# EAGLE design Backplane (EAGLE 9.5.1)

## Sheet 1 of 2
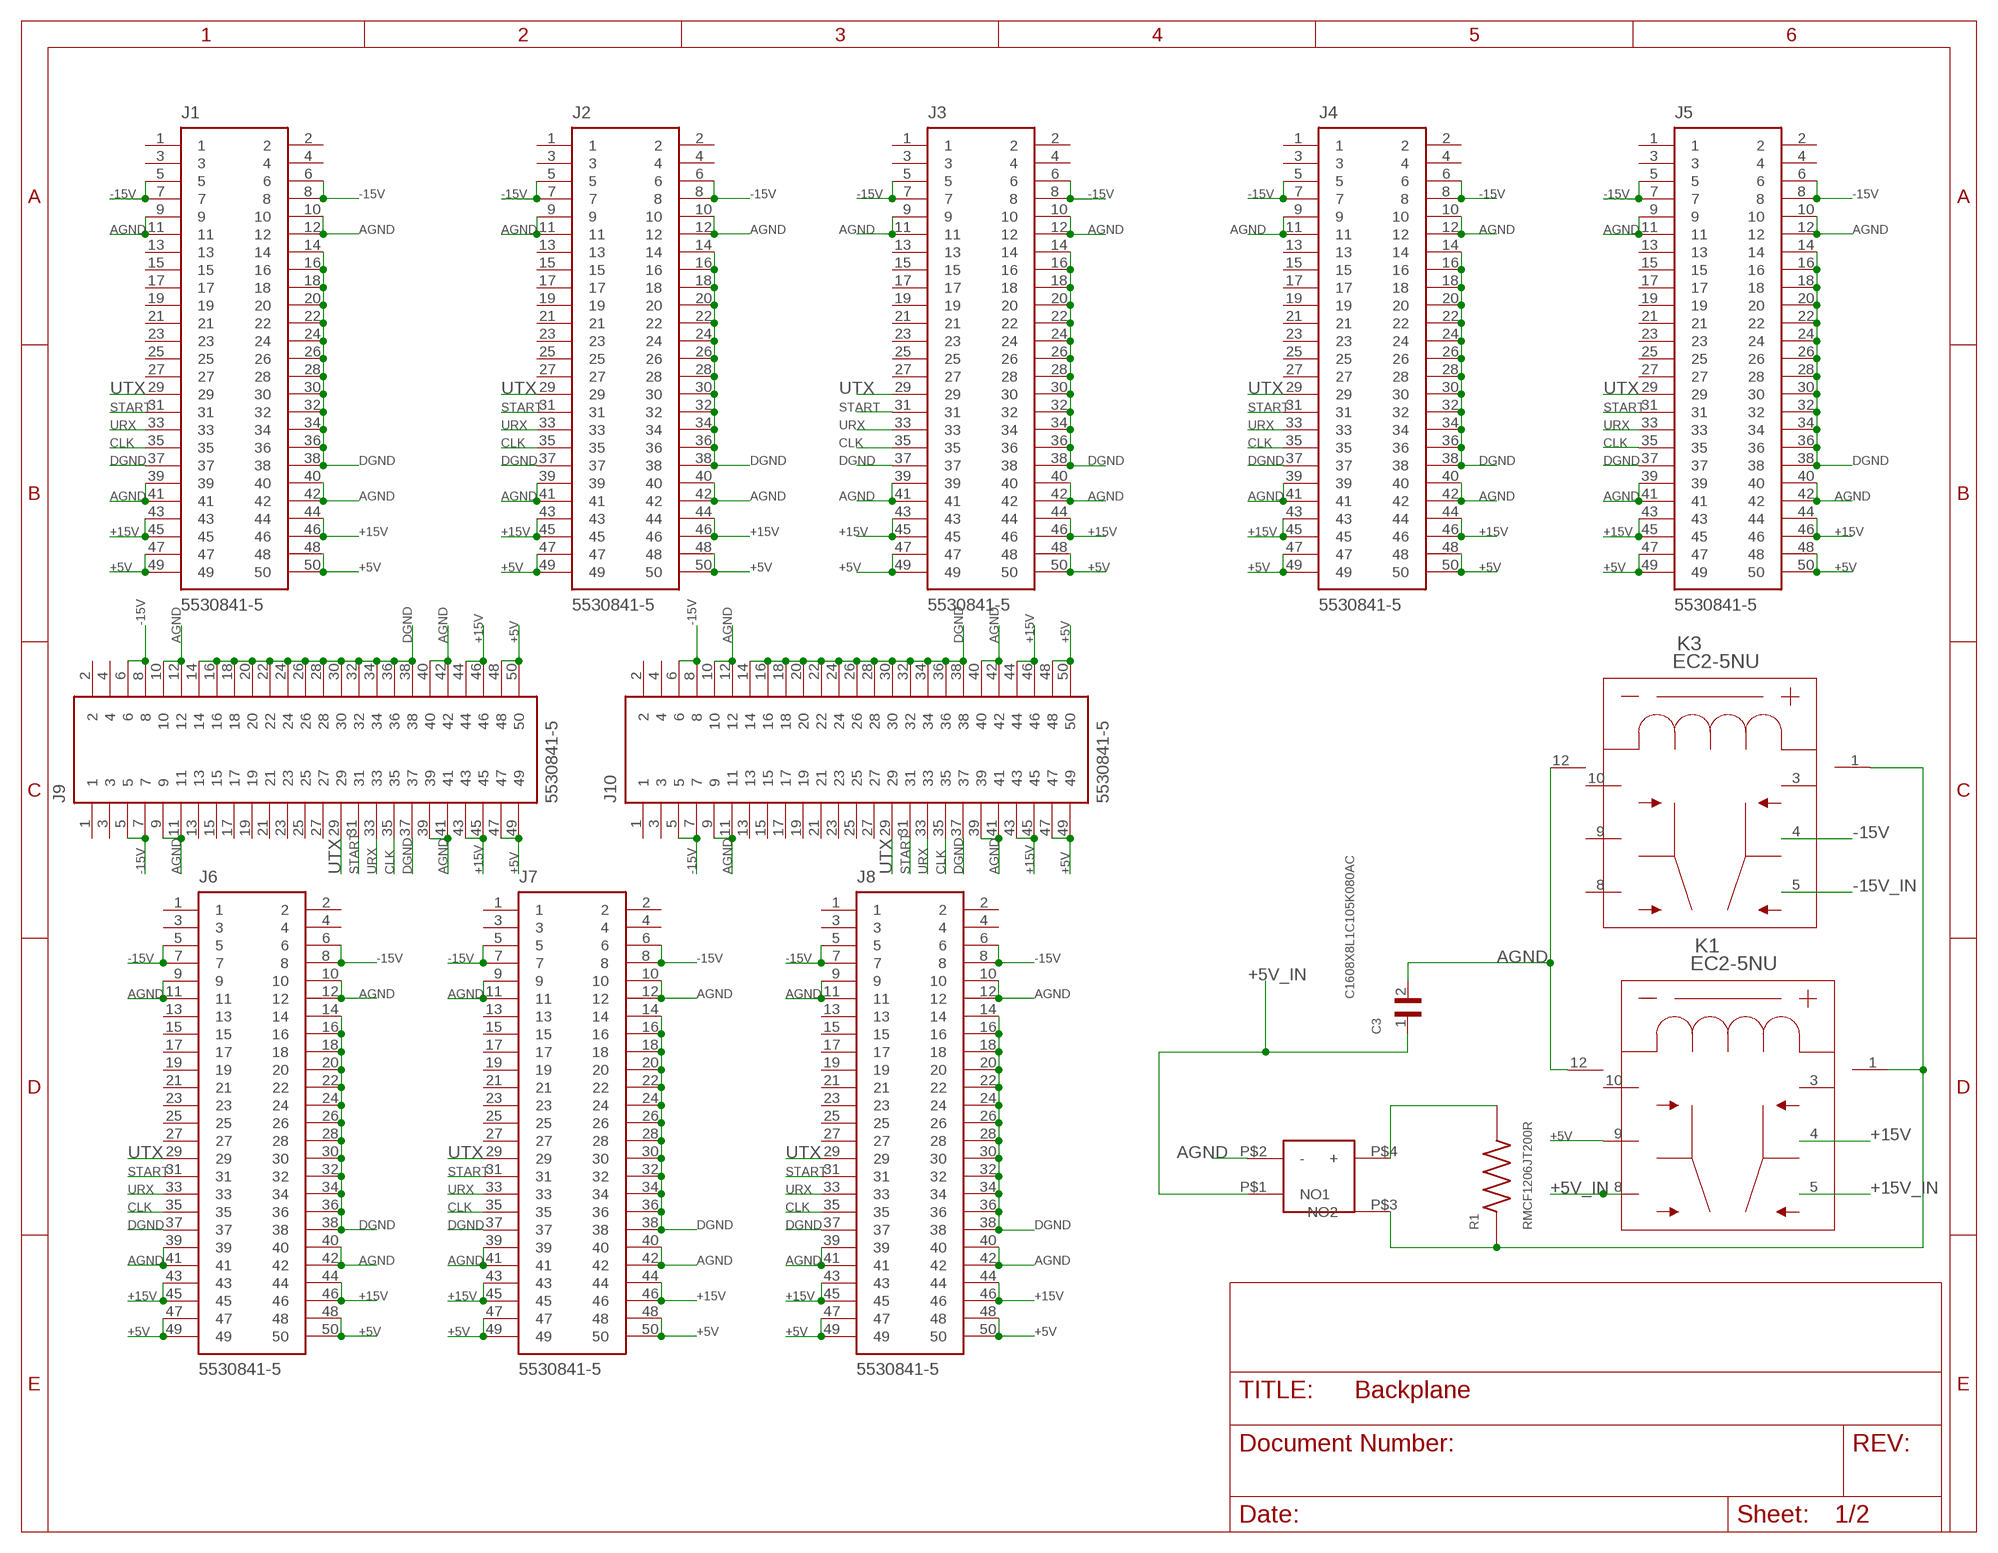
[diagram p0: schematic, sheet 1]

### Parts
C3  C1608X8L1C105K080AC  [CAPC1608X90N]
J1  5530841-5  [TE_5530841-5]
J2  5530841-5  [TE_5530841-5]
J3  5530841-5  [TE_5530841-5]
J4  5530841-5  [TE_5530841-5]
J5  5530841-5  [TE_5530841-5]
J6  5530841-5  [TE_5530841-5]
J7  5530841-5  [TE_5530841-5]
J8  5530841-5  [TE_5530841-5]
J9  5530841-5  [TE_5530841-5]
J10  5530841-5  [TE_5530841-5]
K1  EC2-5NU  [EC2NU]
K3  EC2-5NU  [EC2NU]
R1  RMCF1206JT200R  [RESC3216X70N]
U$1  BUTTON_DEV  [BUTTON_FOOT]

### Nets
+5V: J1.47 J1.48 J1.49 J1.50 J2.47 J2.48 J2.49 J2.50 J3.47 J3.48 J3.49 J3.50 J4.47 J4.48 J4.49 J4.50 J5.47 J5.48 J5.49 J5.50 J6.47 J6.48 J6.49 J6.50 J7.47 J7.48 J7.49 J7.50 J8.47 J8.48 J8.49 J8.50 J9.47 J9.48 J9.49 J9.50 J10.47 J10.48 J10.49 J10.50 K1.9
+5V_IN: C3.1 K1.8 U$1.P$1(NO1) ; also sheet 2
+15V: J1.43 J1.44 J1.45 J1.46 J2.43 J2.44 J2.45 J2.46 J3.43 J3.44 J3.45 J3.46 J4.43 J4.44 J4.45 J4.46 J5.43 J5.44 J5.45 J5.46 J6.43 J6.44 J6.45 J6.46 J7.43 J7.44 J7.45 J7.46 J8.43 J8.44 J8.45 J8.46 J9.43 J9.44 J9.45 J9.46 J10.43 J10.44 J10.45 J10.46 K1.4
+15V_IN: K1.5 ; also sheet 2
-15V: J1.5 J1.6 J1.7 J1.8 J2.5 J2.6 J2.7 J2.8 J3.5 J3.6 J3.7 J3.8 J4.5 J4.6 J4.7 J4.8 J5.5 J5.6 J5.7 J5.8 J6.5 J6.6 J6.7 J6.8 J7.5 J7.6 J7.7 J7.8 J8.5 J8.6 J8.7 J8.8 J9.5 J9.6 J9.7 J9.8 J10.5 J10.6 J10.7 J10.8 K3.4
-15V_IN: K3.5 ; also sheet 2
AGND: C3.2 J1.9 J1.10 J1.11 J1.12 J1.39 J1.40 J1.41 J1.42 J2.9 J2.10 J2.11 J2.12 J2.39 J2.40 J2.41 J2.42 J3.9 J3.10 J3.11 J3.12 J3.39 J3.40 J3.41 J3.42 J4.9 J4.10 J4.11 J4.12 J4.39 J4.40 J4.41 J4.42 J5.9 J5.10 J5.11 J5.12 J5.39 J5.40 J5.41 J5.42 J6.9 J6.10 J6.11 J6.12 J6.39 J6.40 J6.41 J6.42 J7.9 J7.10 J7.11 J7.12 J7.39 J7.40 J7.41 J7.42 J8.9 J8.10 J8.11 J8.12 J8.39 J8.40 J8.41 J8.42 J9.9 J9.10 J9.11 J9.12 J9.39 J9.40 J9.41 J9.42 J10.9 J10.10 J10.11 J10.12 J10.39 J10.40 J10.41 J10.42 K1.12 K3.12 U$1.P$2(-) ; also sheet 2
CLK: J1.35 J2.35 J3.35 J4.35 J5.35 J6.35 J7.35 J8.35 J9.35 J10.35 ; also sheet 2
DGND: J1.14 J1.16 J1.18 J1.20 J1.22 J1.24 J1.26 J1.28 J1.30 J1.32 J1.34 J1.36 J1.37 J1.38 J2.14 J2.16 J2.18 J2.20 J2.22 J2.24 J2.26 J2.28 J2.30 J2.32 J2.34 J2.36 J2.37 J2.38 J3.14 J3.16 J3.18 J3.20 J3.22 J3.24 J3.26 J3.28 J3.30 J3.32 J3.34 J3.36 J3.37 J3.38 J4.14 J4.16 J4.18 J4.20 J4.22 J4.24 J4.26 J4.28 J4.30 J4.32 J4.34 J4.36 J4.37 J4.38 J5.14 J5.16 J5.18 J5.20 J5.22 J5.24 J5.26 J5.28 J5.30 J5.32 J5.34 J5.36 J5.37 J5.38 J6.14 J6.16 J6.18 J6.20 J6.22 J6.24 J6.26 J6.28 J6.30 J6.32 J6.34 J6.36 J6.37 J6.38 J7.14 J7.16 J7.18 J7.20 J7.22 J7.24 J7.26 J7.28 J7.30 J7.32 J7.34 J7.36 J7.37 J7.38 J8.14 J8.16 J8.18 J8.20 J8.22 J8.24 J8.26 J8.28 J8.30 J8.32 J8.34 J8.36 J8.37 J8.38 J9.14 J9.16 J9.18 J9.20 J9.22 J9.24 J9.26 J9.28 J9.30 J9.32 J9.34 J9.36 J9.37 J9.38 J10.14 J10.16 J10.18 J10.20 J10.22 J10.24 J10.26 J10.28 J10.30 J10.32 J10.34 J10.36 J10.37 J10.38 ; also sheet 2
N$3: R1.2 U$1.P$4(+)
N$5: K1.1 K3.1 R1.1 U$1.P$3(NO2)
START: J1.31 J2.31 J3.31 J4.31 J5.31 J6.31 J7.31 J8.31 J9.31 J10.31 ; also sheet 2
URX: J1.33 J2.33 J3.33 J4.33 J5.33 J6.33 J7.33 J8.33 J9.33 J10.33 ; also sheet 2
UTX: J1.29 J2.29 J3.29 J4.29 J5.29 J6.29 J7.29 J8.29 J9.29 J10.29 ; also sheet 2
Unconnected: J1.1 J1.2 J1.3 J1.4 J1.13 J1.15 J1.17 J1.19 J1.21 J1.23 J1.25 J1.27 J2.1 J2.2 J2.3 J2.4 J2.13 J2.15 J2.17 J2.19 J2.21 J2.23 J2.25 J2.27 J3.1 J3.2 J3.3 J3.4 J3.13 J3.15 J3.17 J3.19 J3.21 J3.23 J3.25 J3.27 J4.1 J4.2 J4.3 J4.4 J4.13 J4.15 J4.17 J4.19 J4.21 J4.23 J4.25 J4.27 J5.1 J5.2 J5.3 J5.4 J5.13 J5.15 J5.17 J5.19 J5.21 J5.23 J5.25 J5.27 J6.1 J6.2 J6.3 J6.4 J6.13 J6.15 J6.17 J6.19 J6.21 J6.23 J6.25 J6.27 J7.1 J7.2 J7.3 J7.4 J7.13 J7.15 J7.17 J7.19 J7.21 J7.23 J7.25 J7.27 J8.1 J8.2 J8.3 J8.4 J8.13 J8.15 J8.17 J8.19 J8.21 J8.23 J8.25 J8.27 J9.1 J9.2 J9.3 J9.4 J9.13 J9.15 J9.17 J9.19 J9.21 J9.23 J9.25 J9.27 J10.1 J10.2 J10.3 J10.4 J10.13 J10.15 J10.17 J10.19 J10.21 J10.23 J10.25 J10.27 K1.3 K1.10 K3.3 K3.8 K3.9 K3.10

## Sheet 2 of 2
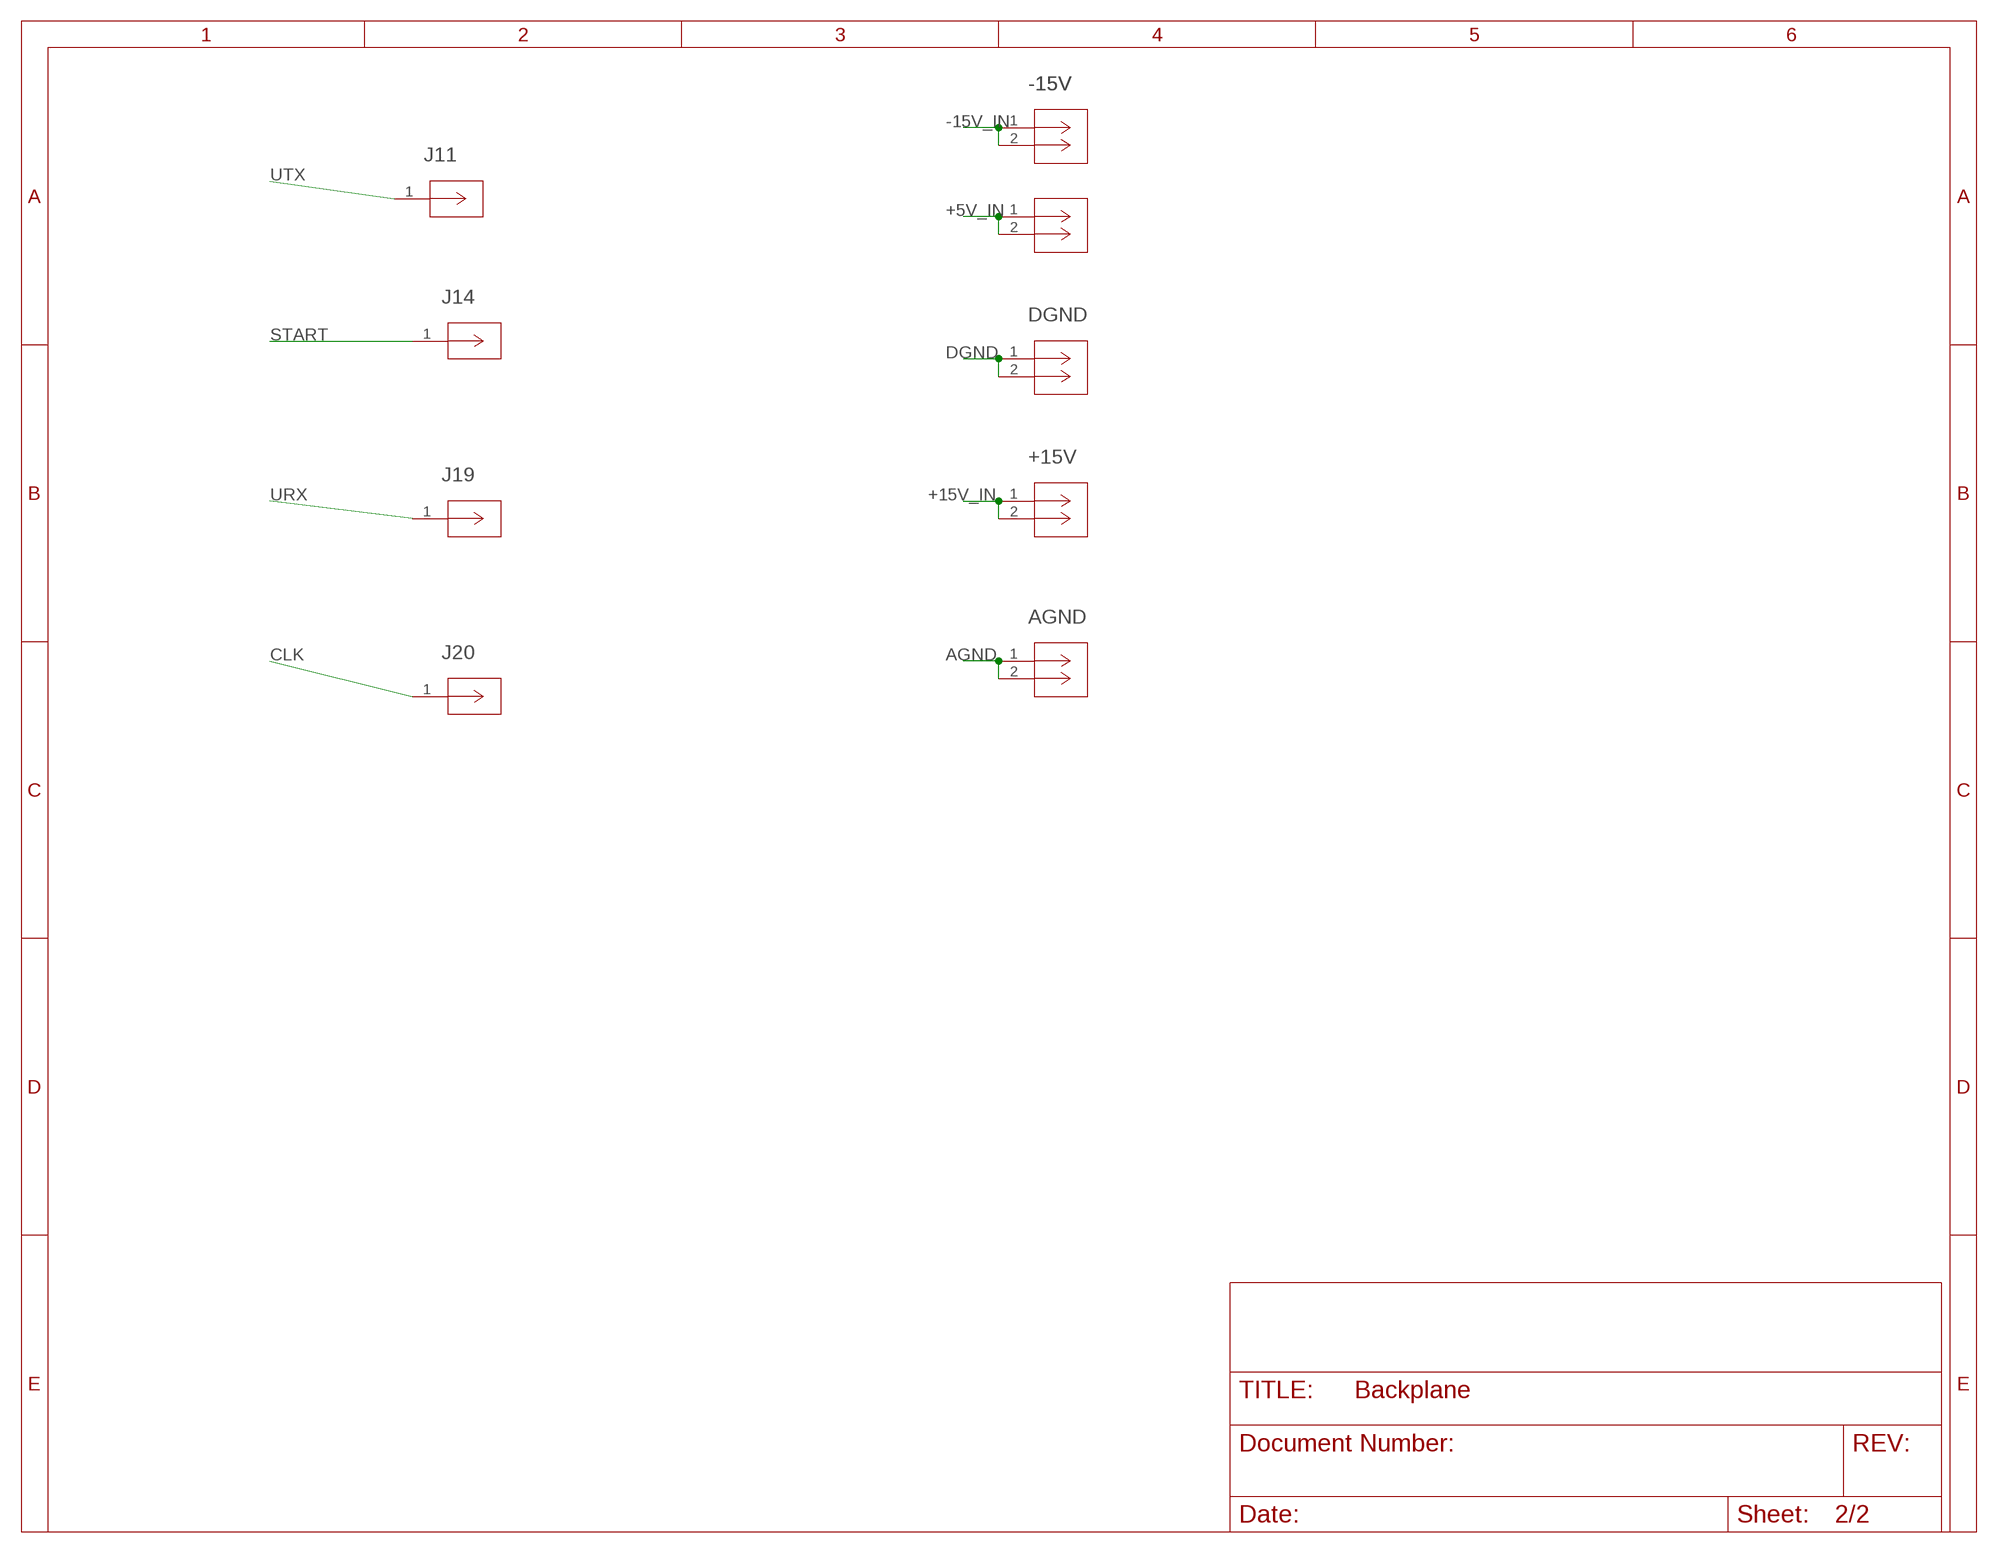
[diagram p1: schematic, sheet 2]

### Parts
+5V  24.243.1  [CONN_24.243_MTC]
+15V  24.243.1  [CONN_24.243_MTC]
-15V  24.243.1  [CONN_24.243_MTC]
AGND  24.243.1  [CONN_24.243_MTC]
DGND  24.243.1  [CONN_24.243_MTC]
J11  112404  [CONN_112404_AMP]
J14  112404  [CONN_112404_AMP]
J19  112404  [CONN_112404_AMP]
J20  112404  [CONN_112404_AMP]

### Nets
+5V_IN: +5V.1 +5V.2 ; also sheet 1
+15V_IN: +15V.1 +15V.2 ; also sheet 1
-15V_IN: -15V.1 -15V.2 ; also sheet 1
AGND: AGND.1 AGND.2 ; also sheet 1
CLK: J20.1 ; also sheet 1
DGND: DGND.1 DGND.2 ; also sheet 1
START: J14.1 ; also sheet 1
URX: J19.1 ; also sheet 1
UTX: J11.1 ; also sheet 1

## Library data of the parts
+5V -15V = 39F1574:24.243.1; COPYRIGHT: Copyright (C) 2022 Ultra Librarian. All rights reserved.; MANUFACTURER_PART_NUMBER: 24.243.1; MFR_NAME: Multicomp
+15V AGND DGND = Banana_connector_24.243.1:24.243.1; BUILT_BY: EMA_Justin; COPYRIGHT: Copyright (C) 2018 Accelerated Designs. All rights reserved; DATASHEET: http://www.farnell.com/datasheets/1901211.pdf?_ga=2.209271186.1695985900.1582574926-861621671.1572890216&_gac=1.224104297.1582574926.CjwKCAiAhc7yBRAdEiwAplGxX0eXyKiGfj62eRMGG7KvwS8fdWH6vWjmriwTUSfyzPNlkVLVCkx_YhoCwGcQAvD_BwE; MANUFACTURER_PART_NUMBER: 24.243.1; SOURCELIBRARY: Multicomp_2020-02-25; VENDOR: Multicomp
C3 = 1uF_cap_C1608X8L1C105K080AC:C1608X8L1C105K080AC; DESCRIPTION: 1µF ±10% 16V Ceramic Capacitor X8L 0603 (1608 Metric); DIGI-KEY_PART_NUMBER: 445-175407-1-ND; MF: TDK; MP: C1608X8L1C105K080AC; PACKAGE: 1608 TDK
J1-J10 = cardEdge5530841-5:5530841-5: Conn Power Card Edge SKT 50 POS 2.54mm Solder ST Thru-Hole; COMMENT: 5530841-5; DESCRIPTION: Conn Power Card Edge SKT 50 POS 2.54mm Solder ST Thru-Hole; DIGI-KEY_PART_NUMBER: 5530841-5-ND; EU_ROHS_COMPLIANCE: Compliant; MF: TE Connectivity; MP: 5530841-5; PACKAGE: None; PURCHASE-URL: https://pricing.snapeda.com/search/part/5530841-5/?ref=eda
J11 J14 J19 J20 = 39F1574:112404; COPYRIGHT: Copyright (C) 2022 Ultra Librarian. All rights reserved.; DIGI-KEY_PART_NUMBER_1: ACX1051-ND; MANUFACTURER_PART_NUMBER: 112404; MFR_NAME: Amphenol ICC
K1 K3 = EC2-5NU:EC2-5NU: EC2-5NU : RELAY GEN PURPOSE DPDT 2A 5V. Miniature Signal Relay, Non-latch; COIL_RESISTANCE: 178 Ohm; COIL_TYPE: Non Latching; CONTACT_CONFIGURATION: DPDT; CONTACT_CURRENT: 5A; CONTACT_VOLTAGE_DC: 220V; CONTACT_VOLTAGE_VAC: 250V; MANUFACTURER_PART_NUMBER: EC25NU; MPN: EC2-5NU; SHORTCUT: EC2; VENDOR: KEMET
R1 = 200ohm_res_RMCF1206JT200R:RMCF1206JT200R; DESCRIPTION: 200 Ohms ±5% 0.25W, 1/4W Chip Resistor 1206 (3216 Metric) Automotive AEC-Q200 Thick Film; DIGI-KEY_PART_NUMBER: RMCF1206JT200RCT-ND; MF: Stackpole Electronics Inc; MP: RMCF1206JT200R; PACKAGE: 3216 Stackpole
U$1 = button_new:BUTTON_DEV

## Board
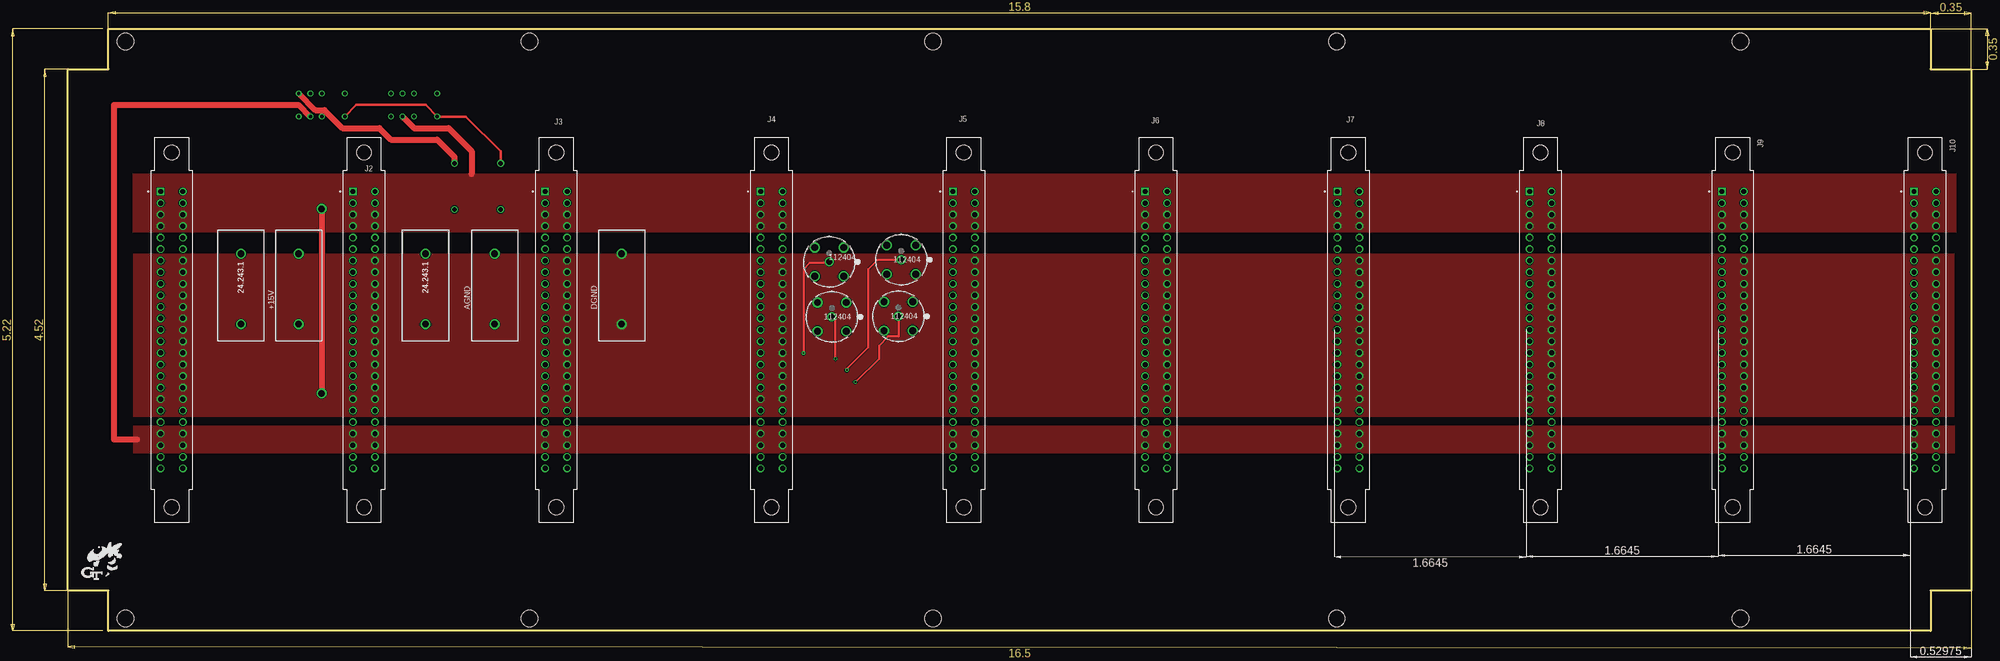
[diagram p2: board, top side]
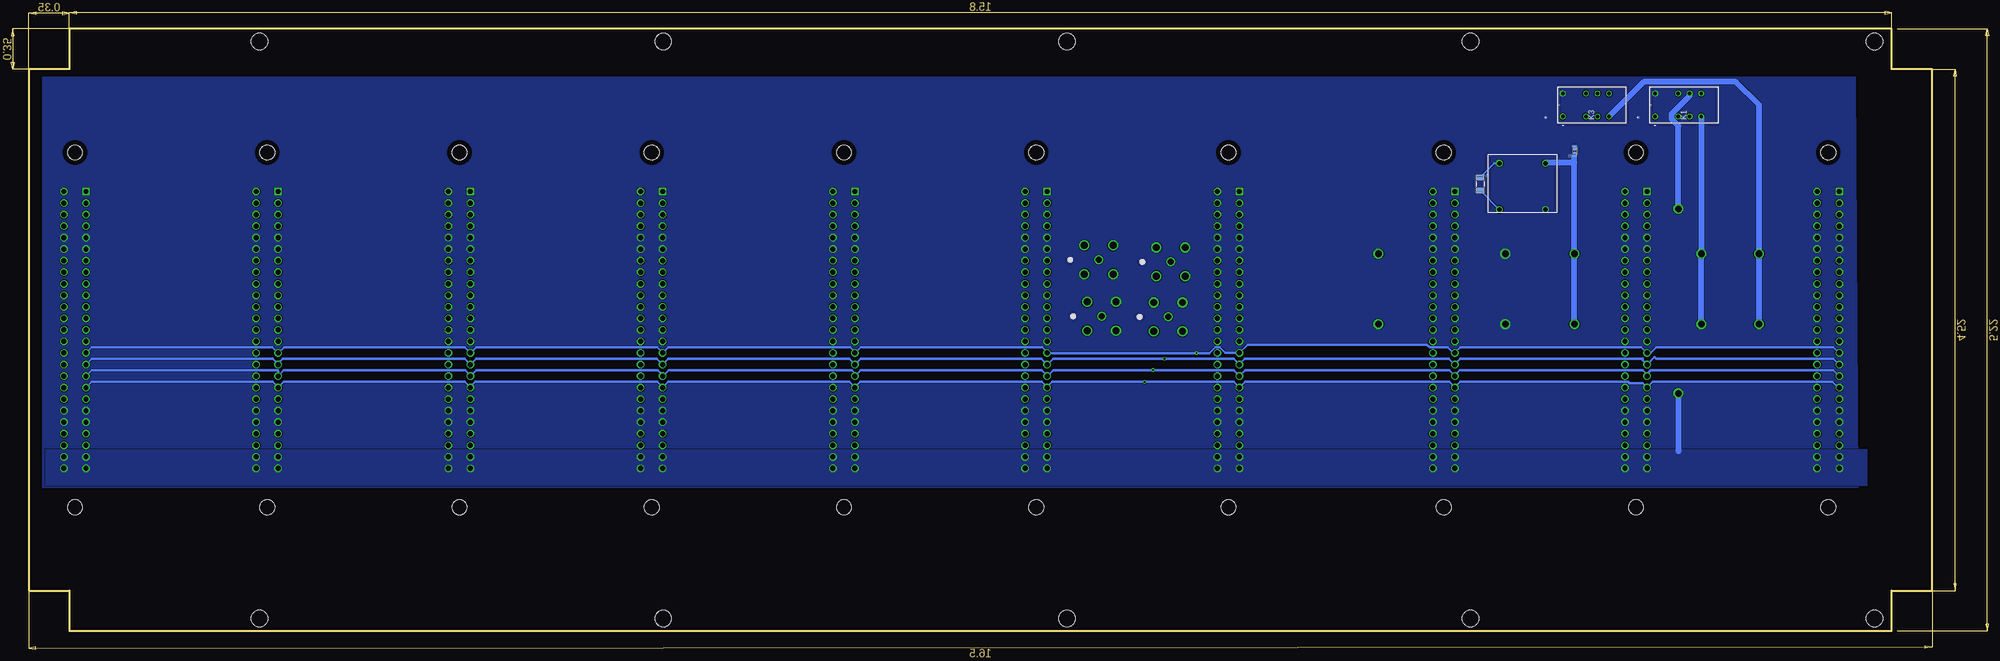
[diagram p3: board, bottom side, seen from below]

Size 419.1 x 132.59 mm. Coordinates in mm from the lower left corner, seen from the top.
Outline: 8.89,132.59 410.21,132.59 410.21,123.7 419.1,123.7 419.1,8.89 410.21,8.89 410.21,0 8.89,0 8.89,8.89 0,8.89 0,123.7 8.89,123.7 8.89,132.59
Copper layers (1*16): Top 0.01778125mm / dielectric 12mil / Bottom 0.01778125mm
Design rules "default *": minimum track width 6mil, minimum drill 0.35mm, track to track 6mil, track to pad 6mil, pad to pad 6mil, via to via 6mil, smd to smd 6mil, copper to edge 40mil, drill to drill 6mil, minimum pad ring 10mil, minimum via ring 8mil, stop-mask expansion 4mil, vias tented up to drill 0mil, thermal gap 10mil
Holes 3.66 mm at 12.7,129.84 190.5,129.84 101.6,129.84 279.4,129.84 101.6,2.74 368.3,129.84 12.7,2.74 190.5,2.74 279.4,2.74 368.3,2.74

### Footprints (pad centres in the part's own frame; a part is rotated, then mirrored left to right if it is on the bottom)
CONN_24.243_MTC = drill 1.448 pad 1.956: 1 0,0; 2 15.494,0
CAPC1608X90N = smd 1.01 x 0.93: 1 -0.709,0; 2 0.709,0
TE_5530841-5 = drill 1.1 square: 1 -30.48,-2.425 | drill 1.1: 2 -30.48,2.425; 3 -27.94,-2.425; 4 -27.94,2.425; 5 -25.4,-2.425; 6 -25.4,2.425; 7 -22.86,-2.425; 8 -22.86,2.425; 9 -20.32,-2.425; 10 -20.32,2.425; 11 -17.78,-2.425; 12 -17.78,2.425; 13 -15.24,-2.425; 14 -15.24,2.425; 15 -12.7,-2.425; 16 -12.7,2.425; 17 -10.16,-2.425; 18 -10.16,2.425; 19 -7.62,-2.425; 20 -7.62,2.425; 21 -5.08,-2.425; 22 -5.08,2.425; 23 -2.54,-2.425; 24 -2.54,2.425; 25 0,-2.425; 26 0,2.425; 27 2.54,-2.425; 28 2.54,2.425; 29 5.08,-2.425; 30 5.08,2.425; 31 7.62,-2.425; 32 7.62,2.425; 33 10.16,-2.425; 34 10.16,2.425; 35 12.7,-2.425; 36 12.7,2.425; 37 15.24,-2.425; 38 15.24,2.425; 39 17.78,-2.425; 40 17.78,2.425; 41 20.32,-2.425; 42 20.32,2.425; 43 22.86,-2.425; 44 22.86,2.425; 45 25.4,-2.425; 46 25.4,2.425; 47 27.94,-2.425; 48 27.94,2.425; 49 30.48,-2.425; 50 30.48,2.425 | hole 3.3: -39.05,0; 39.05,0
CONN_112404_AMP = drill 1.295 pad 1.803: 1 0,0 | drill 1.499 pad 2.007: 2 -3.175,3.175; 3 3.175,3.175; 4 -3.175,-3.175; 5 3.175,-3.175
EC2NU = drill 0.762 pad 1.27: 1 -5.08,12.725; 3 -5.08,7.645; 4 -5.08,5.105; 5 -5.08,2.565; 8 0,2.565; 9 0,5.105; 10 0,7.645; 12 0,12.725
RESC3216X70N = smd 1.23 x 1.77: 1 -1.466,0; 2 1.466,0
BUTTON_FOOT = drill 1: P$1 0,0; P$2 0,10.16; P$3 10.16,0; P$4 10.16,10.16

### Placement (x,y rotation side)
+5V  78.74,67.56 90 top
+15V  50.8,67.56 90 top
-15V  38.1,67.56 90 top
AGND  93.98,67.56 90 top
C3  78.74,105.66 90 bottom
DGND  121.92,67.56 90 top
DRILEGEND  [DRILEGEND]  -15.3,-11.53 0 top  (outside the outline)
J1  22.86,66.29 270 top
J2  65.19,66.29 270 top
J3  107.53,66.29 270 top
J4  154.94,66.29 270 top
J5  197.28,66.29 270 top
J6  239.61,66.29 270 top
J7  281.95,66.29 270 top
J8  324.28,66.29 270 top
J9  366.61,66.29 270 top
J10  408.95,66.29 270 top
J11  167.65,81.29 0 top
J14  168.22,69.17 0 top
J19  183.51,81.75 0 top
J20  182.87,69.3 0 top
K1  48.26,118.36 90 bottom
K3  68.58,118.36 90 bottom
R1  99.55,98.43 270 bottom
U$1  85.11,102.97 180 bottom

### Tracks (layer width: path | path; a pad name or v marks a point on that pad's centre or on a via)
+5V  (via drill 1.45)
  Top 1.27: v55.88,92.96 v55.88,52.32
  Bottom 1.27: v55.88,52.32 55.88,39.62 | K1.9 53.37,117.84 57.33,113.87 57.33,112.7 55.88,111.25 v55.88,92.96
  pour Bottom (no thermals): 14.35,31.98 415.43,31.98 415.43,40.11 14.35,40.05
+5V_IN
  Top 1.27: K1.8 54.48,114.71 56.49,114.71 60.46,110.74 68.58,110.74 71.12,108.2 81.28,108.2 85.11,104.37 U$1.P$1
  Bottom 1.27: +5V.1 +5V.2 78.74,103.12 | 78.74,103.12 C3.1 | 78.74,103.12 84.95,103.12 U$1.P$1
+15V
  Top 1.27: 15.24,42.16 10.16,42.16 10.16,115.82 50.83,115.82 K1.4
  pour Top (no thermals): 14.43,39.2 415.47,39.2 415.47,45.16 14.38,45.06
+15V_IN
  Bottom 1.27: +15V.1 +15V.2 50.8,113.26 K1.5
-15V
  Top 1.27: K3.4 76.2,110.77 76.2,110.74 83.82,110.74 88.9,105.66 88.9,100.58
  pour Top (no thermals): 415.72,87.83 14.4,87.83 14.4,100.69 415.72,100.69
-15V_IN
  Bottom 1.27: -15V.1 -15V.2 38.1,115.82 43.18,120.9 63.52,120.9 K3.5
AGND
  pour Bottom (rank 2, no thermals): 16.4,31.57 416.04,31.57 416.04,122.08 16.88,122.08
CLK  (via drill 0.35)
  Top 0.508: J20.1 182.97,69.2 182.97,64.87 180.68,64.87 178.65,62.84 178.61,62.84 178.61,59.94 173.49,54.83 v173.38,54.83
  Bottom 0.152: J5.35 194.94,53.69 | 364.19,53.67 J9.35 | 321.96,53.7 J8.35
  Bottom 0.508: J1.35 20.69,53.59 22,54.89 61.47,54.89 J2.35 63.74,54.56 66.68,54.56 66.95,54.84 103.86,54.84 J3.35 106.35,54.84 151.27,54.84 J4.35 153.75,54.83 v173.38,54.83 193.77,54.83 194.94,53.69 196.08,54.83 236.08,54.83 J6.35 238.45,54.86 278.25,54.86 J7.35 280.75,54.83 320.83,54.83 321.96,53.7 323.12,54.86 362.92,54.86 J9.35 | J10.35 405.27,54.84 365.36,54.84 364.19,53.67
DGND
  pour Top (no thermals): 14.4,82.96 14.4,47.23 415.4,47.23 415.4,82.96
N$3
  Bottom 0.508: U$1.P$4 99.43,96.96 R1.2
N$5
  Top 0.508: U$1.P$3 95.27,105.66 87.65,113.28 K3.1 81.28,113.28 78.74,115.82 63.52,115.82 K1.1
  Bottom 0.508: R1.1 96.41,103.04 95.34,103.04 U$1.P$3
START  (via drill 0.35)
  Top 0.508: J14.1 169.02,68.38 v169.02,59.95
  Bottom 0.152: 61.14,60.3 61.12,60.3 | 63.72,59.91 63.72,59.62 | 152.52,58.85 J4.31 | J9.31 364.19,58.9
  Bottom 0.508: J1.31 21.71,59.95 60.77,59.95 61.12,60.3 | 61.14,60.3 J2.31 63.72,59.62 | 63.72,59.91 103.86,59.91 J3.31 106.4,59.97 108.56,59.97 108.56,59.96 151.41,59.96 152.52,58.85 | J4.31 153.79,59.95 168.9,59.95 | J10.31 405.28,59.92 365.43,59.92 J9.31 | 364.19,58.9 363.14,59.94 323.12,59.94 J8.31 320.58,59.95 280.8,59.95 J7.31 278.25,59.94 238.45,59.94 J6.31 235.9,59.96 196.17,59.96 194.88,58.67 J5.31 193.57,59.96 168.91,59.96 168.9,59.95 | 168.9,59.95 v169.02,59.95
URX  (via drill 0.35)
  Top 0.508: J19.1 178.35,81.75 176.29,79.69 176.29,62.48 171.53,57.73 v171.53,57.43
  Bottom 0.152: 62.77,56.54 J2.33 62.77,56.48 | 105.1,56.26 J3.33 | 321.85,56.21 J8.33 | 279.52,56.3 J7.33 | 237.19,56.71 J6.33
  Bottom 0.508: v171.54,57.44 v171.53,57.43 | J1.33 21.76,57.46 21.99,57.46 21.9,57.37 61.94,57.37 62.77,56.54 | 62.77,56.48 63.68,57.4 103.97,57.4 105.1,56.26 | J3.33 106.37,57.4 151.29,57.4 152.52,56.17 | J10.33 405.28,57.37 364.33,57.37 364.19,57.23 J9.33 362.95,57.37 323.02,57.37 321.85,56.21 | J8.33 320.61,57.38 280.61,57.38 279.52,56.3 | J7.33 278.25,57.4 237.88,57.4 237.19,56.71 | J6.33 235.9,57.42 196.07,57.42 194.85,56.21 J5.33 193.55,57.44 v171.54,57.44 | 152.52,56.17 J4.33 | 152.52,56.17 153.78,57.44 v171.54,57.44
UTX  (via drill 0.35)
  Top 0.508: J11.1 167.43,81.07 163.38,81.07 162,79.69 v162,61.19
  Bottom 0.152: 105.1,61.32 105.29,61.32 | J3.29 105.45,61.21 | 194.83,61.19 J5.29 194.85,61.4 | J6.29 237.19,61.47 | J8.29 321.85,61.28
  Bottom 0.508: J3.29 105.29,61.32 | J1.29 21.73,62.5 60.71,62.5 62,61.21 J2.29 64.03,62.47 103.94,62.47 105.1,61.32 | 105.45,61.21 106.7,62.47 110.65,62.47 111.23,63.05 150.68,63.05 J4.29 155.63,61.21 156.86,62.45 157.88,62.45 159.13,61.19 v162,61.19 183.95,61.19 194.83,61.19 | J6.29 235.93,62.47 195.92,62.47 194.85,61.4 | 237.19,61.47 238.18,62.46 278.27,62.46 J7.29 280.78,62.47 320.59,62.47 J8.29 | 321.85,61.28 323.08,62.5 362.9,62.5 J9.29 365.48,62.5 405.23,62.5 J10.29

### Text on the board
DrillLegend: LAYER-STACK
DrillLegend_01-16: 01-16
DrillLegend_01-20: 01-20